# EAGLE design EnviroTron (EAGLE 8.5.0)
AUTHOR: w. boyett; CONTACT_ADDRESS: Licensed under CC-BY-SA; CONTACT_COMPANY: github.com/watsonboyett; CONTACT_PHONE: (Creative Commons, Attribution + Share Alike); REV: 1E
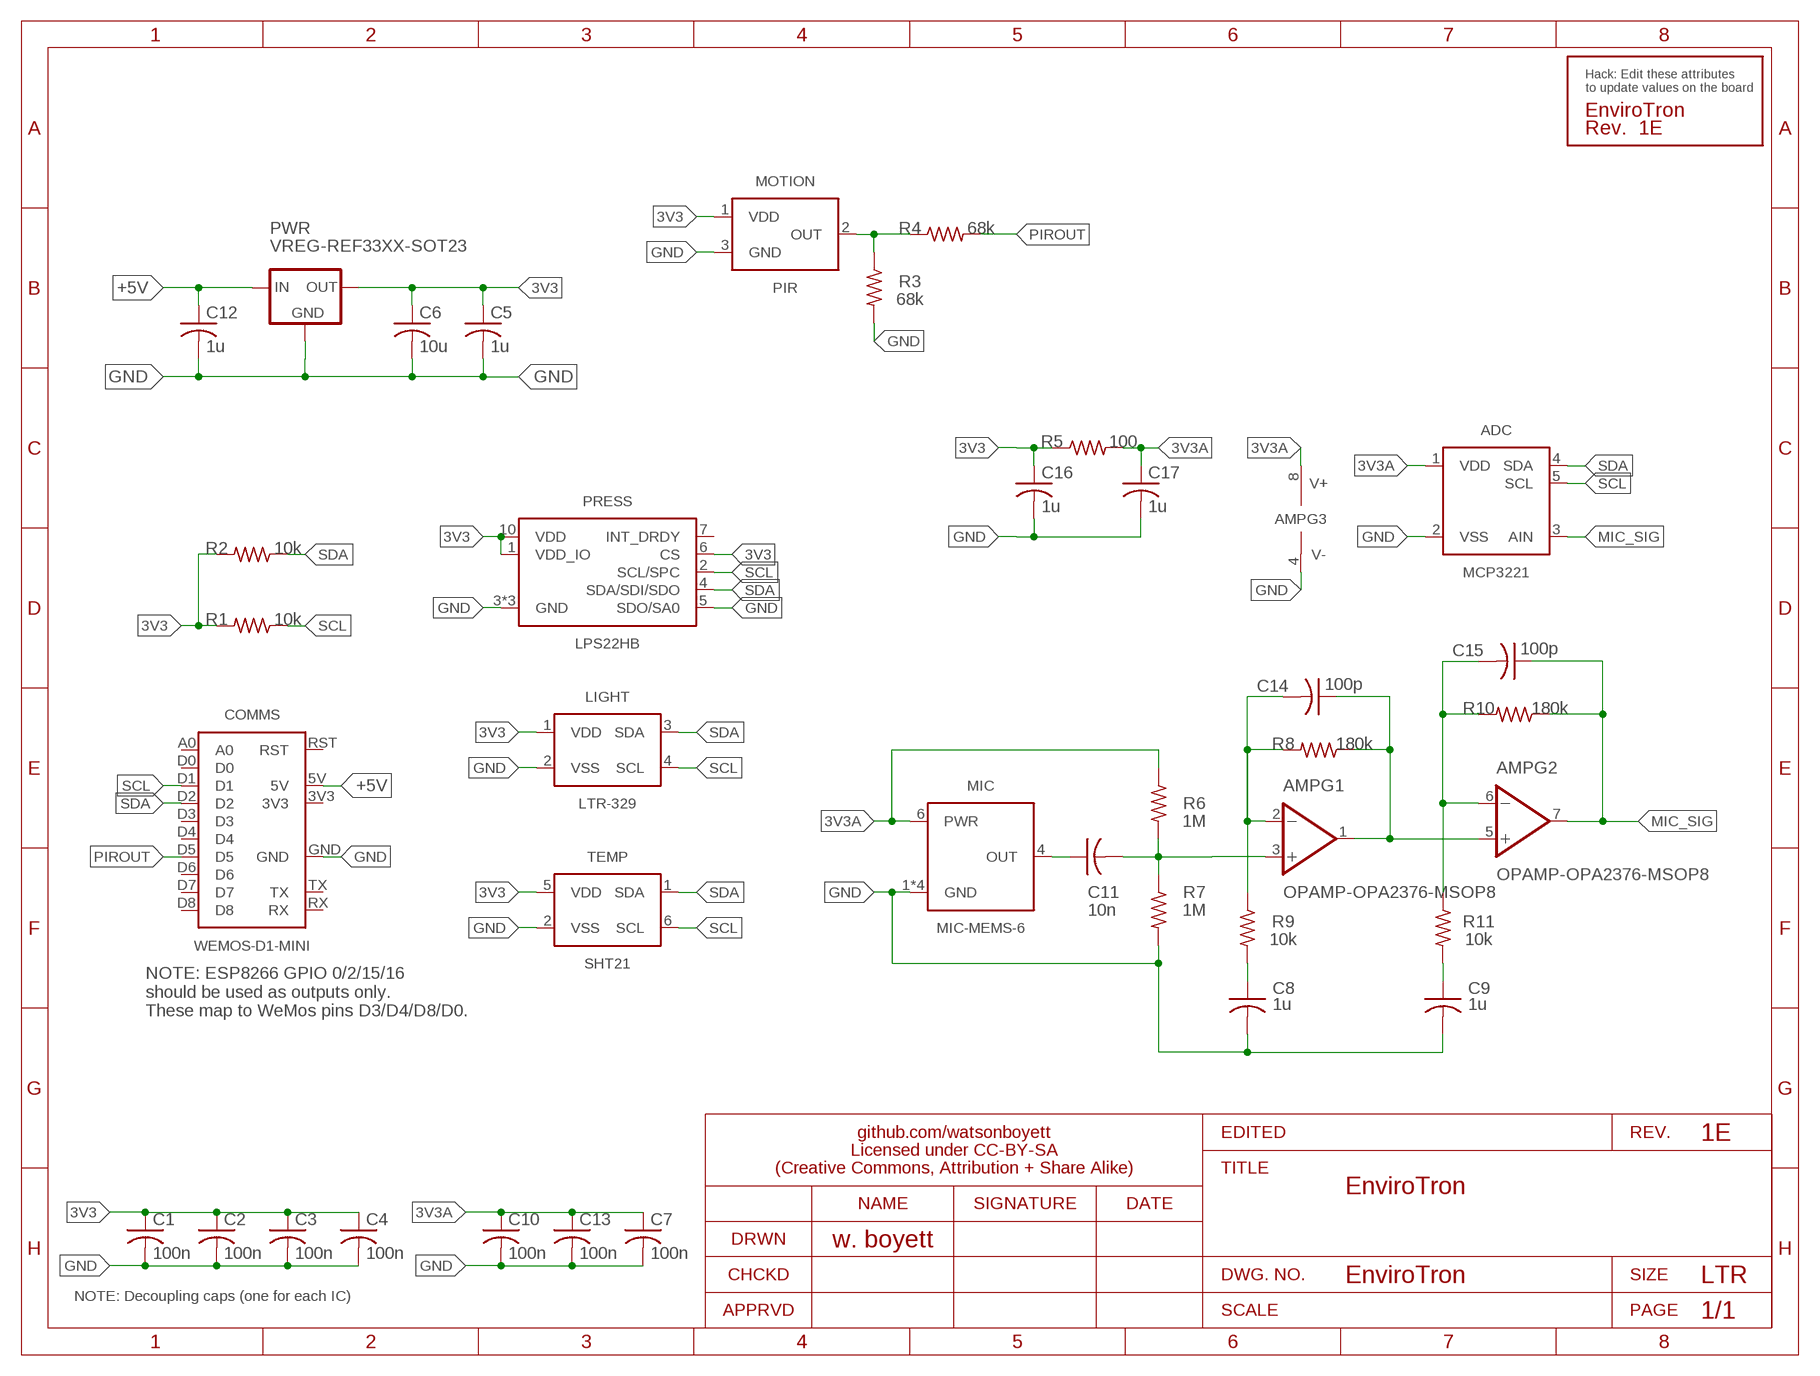
[diagram p0: schematic, sheet 1]
FRAME1 (LETTER_L): SECTION: Sensor Board

## Parts
ADC  MCP3221  [SOT23-5]
AMP  OPAMP-OPA2376-MSOP8  [MSOP-8]
C1  100n  C-USC0603  [C0603]
C2  100n  C-USC0603  [C0603]
C3  100n  C-USC0603  [C0603]
C4  100n  C-USC0603  [C0603]
C5  1u  C-USC0603  [C0603]
C6  10u  C-USC0805  [C0805]
C7  100n  C-USC0603  [C0603]
C8  1u  C-USC0603  [C0603]
C9  1u  C-USC0603  [C0603]
C10  100n  C-USC0603  [C0603]
C11  10n  C-USC0603  [C0603]
C12  1u  C-USC0603  [C0603]
C13  100n  C-USC0603  [C0603]
C14  100p  C-USC0603  [C0603]
C15  100p  C-USC0603  [C0603]
C16  1u  C-USC0603  [C0603]
C17  1u  C-USC0603  [C0603]
COMMS  WEMOS-D1-MINI  [WEMOS-D1-MINI]
LIGHT  LTR-329  [CHIPLED4]
MIC  MIC-MEMS-6  [DFN-6]
MOTION  PIR  [CAN3]
PRESS  LPS22HB  [HLGA-10L]
PWR  VREG-REF33XX-SOT23  [SOT23-3]
R1  10k  R-US_R0603  [R0603]
R2  10k  R-US_R0603  [R0603]
R3  68k  R-US_R0603  [R0603]
R4  68k  R-US_R0603  [R0603]
R5  100  R-US_R0603  [R0603]
R6  1M  R-US_R0603  [R0603]
R7  1M  R-US_R0603  [R0603]
R8  180k  R-US_R0603  [R0603]
R9  10k  R-US_R0603  [R0603]
R10  180k  R-US_R0603  [R0603]
R11  10k  R-US_R0603  [R0603]
TEMP  SHT21  [SHT2X-DFN6]
U$1  SILK_QC  [SILK_QC]

## Nets
3V3: C1.1 C2.1 C3.1 C4.1 C5.1 C6.1 C16.1 LIGHT.1(VDD) MOTION.1(VDD) PRESS.1(VDD_IO) PRESS.6(CS) PRESS.10(VDD) PWR.2(OUT) R1.2 R2.2 R5.1 TEMP.5(VDD)
3V3A: ADC.1(VDD) AMP.8(V+) C7.1 C10.1 C13.1 C17.1 MIC.6(PWR) R5.2 R6.1
+5V: C12.1 COMMS.5V PWR.1(IN)
GND: ADC.2(VSS) AMP.4(V-) C1.2 C2.2 C3.2 C4.2 C5.2 C6.2 C7.2 C8.2 C9.2 C10.2 C12.2 C13.2 C16.2 C17.2 COMMS.GND LIGHT.2(VSS) MIC.1(GND) MIC.2(GND) MIC.3(GND) MIC.5(GND) MOTION.3(GND) PRESS.3(GND) PRESS.5(SDO/SA0) PRESS.8(GND) PRESS.9(GND) PWR.3(GND) R3.2 R7.2 TEMP.2(VSS)
MIC_OUT: AMP.3(+IN) C11.2 R6.2 R7.1
MIC_SIG: ADC.3(AIN) AMP.7(OUT) C15.1 R10.1
N$2: AMP.1(OUT) AMP.5(+IN) C14.1 R8.1
N$3: MOTION.2(OUT) R3.1 R4.1
N$6: AMP.2(-IN) C14.2 R8.2 R9.1
N$7: C8.1 R9.2
N$8: C11.1 MIC.4(OUT)
N$9: AMP.6(-IN) C15.2 R10.2 R11.1
N$10: C9.1 R11.2
PIROUT: COMMS.D5 R4.2
SCL: ADC.5(SCL) COMMS.D1 LIGHT.4(SCL) PRESS.2(SCL/SPC) R1.1 TEMP.6(SCL)
SDA: ADC.4(SDA) COMMS.D2 LIGHT.3(SDA) PRESS.4(SDA/SDI/SDO) R2.1 TEMP.1(SDA)
Unconnected: COMMS.3V3 COMMS.A0 COMMS.D0 COMMS.D3 COMMS.D4 COMMS.D6 COMMS.D7 COMMS.D8 COMMS.RST COMMS.RX COMMS.TX PRESS.7(INT_DRDY)

## Notes on the sheet
- NOTE: ESP8266 GPIO 0/2/15/16 
  should be used as outputs only. 
  These map to WeMos pins D3/D4/D8/D0.
- NOTE: Decoupling caps (one for each IC)

## Library data of the parts
ADC = EnviroTron:MCP3221: IC ADC 12 Bit Analog to Digital Converter 1 Input 1 SAR SOT-23-5; MFG: Microchip Technology; MPN: MCP3221A5T-I/OT; PN-DK: MCP3221A5T-I/OTCT-ND
AMP = EnviroTron:OPAMP: IC OPAMP General Purpose Amplifier Circuit Rail-to-Rail; MFG: Texas Instruments; MPN: OPA2376AIDGKR; PN-DK: 296-22630-1-ND; SPICEPREFIX: J
C1-C17 = EnviroTron:C-US: CAPACITOR, American symbol
COMMS = EnviroTron:WEMOS-D1-MINI; SPICEPREFIX: X
LIGHT = EnviroTron:LTR-329: AMBIENT LIGHT PHOTO SENSOR Optical Sensor Ambient I²C; MFG: Lite-On Inc.; MPN: LTR-329ALS-01; PN-DK: 160-2160-1-ND
MIC = EnviroTron:MIC-MEMS: MEMS MIC Analog 100Hz ~ 10kHz (Silicon) 1.5 ~ 3.6V Omnidirectional (-42dB ±3dB @ 94dB SPL)
MOTION = EnviroTron:PIR: Sensor Motion, Pyroelectric, PIR (Passive Infrared) 197" (5m) 16.4' Polyethylene, Black Lens; MFG: Panasonic Electric Works; MPN: EKMC1601112; PN-DK: 255-3075-ND
PRESS = EnviroTron:LPS22HB: Pressure Sensor 3.77 PSI ~ 18.27 PSI (26 kPa ~ 126 kPa) Absolute 24 bit; MFG: STMicroelectronics; MPN: LPS22HBTR; PN-DK: 497-16265-1-ND
PWR = EnviroTron:VREG: IC Linear Voltage Regulator/Reference; MFG: Texas Instruments; MPN: REF3033AIDBZR; PN-DK: 296-26324-1-ND
R1-R11 = EnviroTron:R-US_: RESISTOR, American symbol
TEMP = EnviroTron:SHT21: SENSOR Humidity/Temperature 3V I2C 2%; MFG: Sensirion AG; MPN: SHT21; PN-DK: 1649-1005-1-ND
U$1 = EnviroTron:SILK_QC: Model/Version Tag Silkscreen; MPN: DNP; PRODUCT: EnviroTron; REV: 1E

## Board
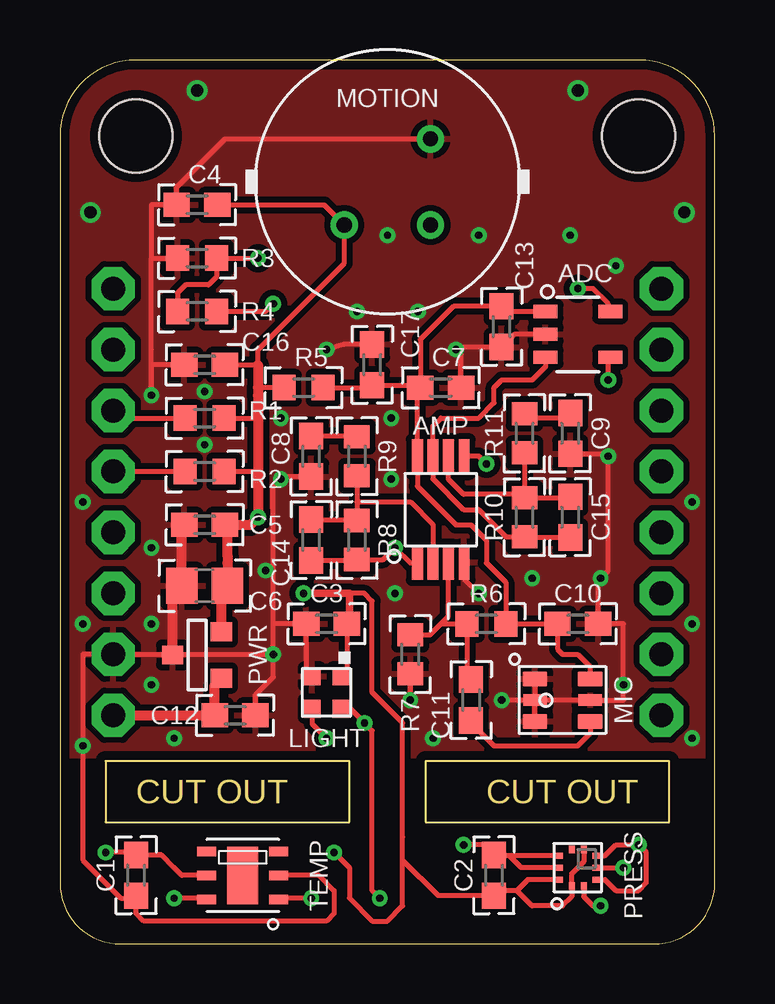
[diagram p1: board, top side]
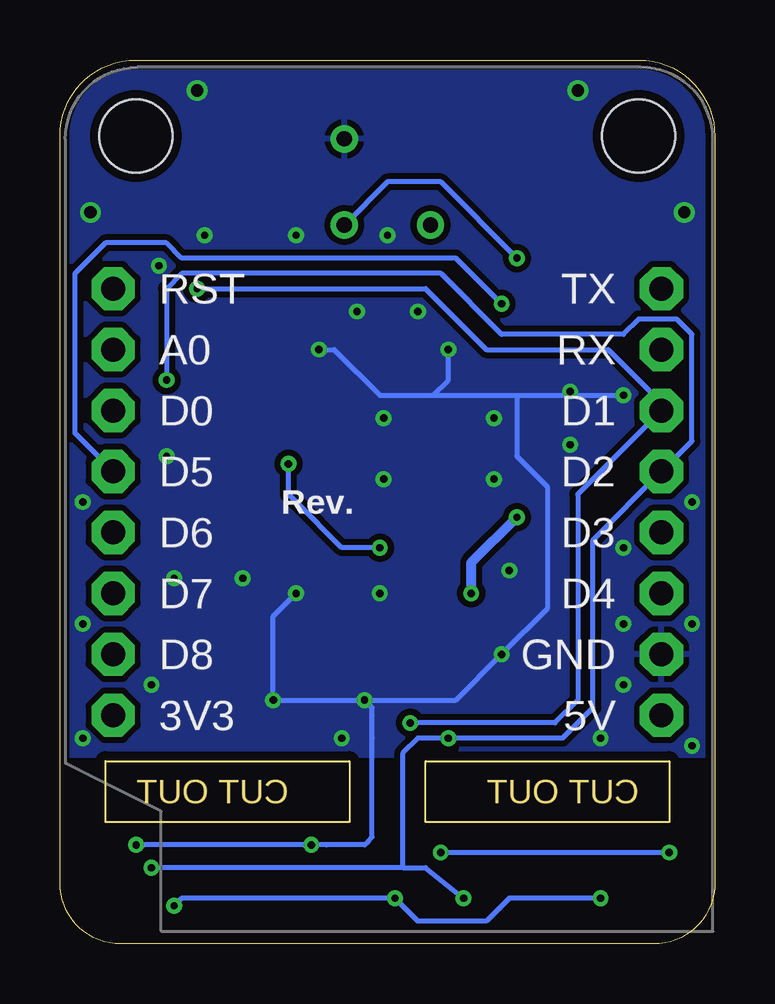
[diagram p2: board, bottom side, seen from below]

Size 27.3 x 36.83 mm. Coordinates in mm from the lower left corner, seen from the top.
Outline: 24.13,36.83 3.17,36.83 arc90 0,33.66 0,2.54 arc90 2.54,0 24.77,0 arc90 27.3,2.54 27.3,33.66 arc90 24.13,36.83
Outline: 1.91,7.62 1.91,5.08 12.06,5.08 12.06,7.62 1.91,7.62
Outline: 15.24,7.62 15.24,5.08 25.4,5.08 25.4,7.62 15.24,7.62
Copper layers (1*16): Top 0.0356mm / dielectric 1.5011mm / Bottom 0.0356mm
Design rules "OshPark-2layer-loosetol *": minimum track width 8mil, minimum drill 10mil, track to track 8mil, track to pad 8mil, pad to pad 7mil, via to via 8mil, smd to smd 7mil, copper to edge 15mil, drill to drill 6mil, minimum pad ring 10mil, minimum via ring 7mil, stop-mask expansion 2.5mil, vias tented up to drill 20mil, thermal gap 10mil
Holes 3.05 mm at 3.17,33.66 24.13,33.66

### Footprints (pad centres in the part's own frame; a part is rotated, then mirrored left to right if it is on the bottom)
SOT23-5 = smd 0.55 x 1: 1 -0.95,-1.35; 2 0,-1.35; 3 0.95,-1.35; 4 0.95,1.35; 5 -0.95,1.35
MSOP-8 = smd 0.45 x 1.45: 1 -0.975,-2.2; 2 -0.325,-2.2; 3 0.325,-2.2; 4 0.975,-2.2; 5 0.975,2.2; 6 0.325,2.2; 7 -0.325,2.2; 8 -0.975,2.2
C0603 = smd 1.1 x 1: 1 -0.85,0; 2 0.85,0
C0805 = smd 1.3 x 1.5: 1 -0.95,0; 2 0.95,0
WEMOS-D1-MINI = drill 1 octagon: 3V3 -11.43,-8.89; 5V 11.43,-8.89; A0 -11.43,6.35; D0 -11.43,3.81; D1 11.43,3.81; D2 11.43,1.27; D3 11.43,-1.27; D4 11.43,-3.81; D5 -11.43,1.27; D6 -11.43,-1.27; D7 -11.43,-3.81; D8 -11.43,-6.35; GND 11.43,-6.35; RST -11.43,8.89; RX 11.43,6.35; TX 11.43,8.89
CHIPLED4 = smd 0.7 x 0.75: 1 -0.6,-0.675; 2 0.6,-0.675; 3 0.6,0.675; 4 -0.6,0.675
DFN-6 = smd 1.032 x 0.622: 1 -1.15,0.884; 3 -1.15,-0.884; 4 1.15,-0.884; 6 1.15,0.884 | smd 1.032 x 0.5: 2 -1.15,0; 5 1.15,0
CAN3 = drill 0.635: 1 -1.796,-1.796; 2 1.796,-1.796; 3 1.796,1.796
HLGA-10L = smd 0.3 x 0.25: 1 -0.762,0.25; 2 -0.762,-0.25; 6 0.762,-0.25; 7 0.762,0.25 | smd 0.25 x 0.3: 3 -0.5,-0.762; 4 0,-0.762; 5 0.5,-0.762; 8 0.5,0.762; 9 0,0.762; 10 -0.5,0.762
SOT23-3 = smd 0.889 x 0.787: 1 1.016,-0.991; 2 1.016,0.94; 3 -1.016,-0.025
R0603 = smd 0.965 x 1.067: 1 -0.813,0; 2 0.813,0
SHT2X-DFN6 = smd 0.4 x 0.8: 1 -1,-1.5; 2 0,-1.5; 3 1,-1.5; 4 1,1.5; 5 0,1.5; 6 -1,1.5 | smd 2.4 x 1.3: 7 0,0

### Placement (x,y rotation side)
ADC  21.59,25.4 270 top
AMP  15.88,18.1 0 top
C1  3.17,2.86 270 top
C2  18.1,2.86 90 top
C3  11.11,13.34 180 top
C4  5.71,30.8 180 top
C5  6.03,17.46 180 top
C6  6.03,14.92 180 top
C7  15.88,23.18 0 top
C8  10.48,20.32 270 top
C9  21.27,21.27 270 top
C10  21.59,13.34 0 top
C11  17.14,10.16 90 top
C12  7.3,9.53 0 top
C13  18.41,25.72 270 top
C14  10.48,16.83 90 top
C15  21.27,17.78 90 top
C16  6.03,24.13 180 top
C17  13.02,24.13 90 top
COMMS  13.65,18.41 0 bottom
LIGHT  11.11,10.48 180 top
MIC  20.95,10.16 0 top
MOTION  13.65,31.75 0 top
PRESS  21.59,3.17 90 top
PWR  5.71,12.06 0 top
R1  6.03,21.91 0 top
R2  6.03,19.68 0 top
R3  5.71,28.57 180 top
R4  5.71,26.35 0 top
R5  10.16,23.18 0 top
R6  17.78,13.34 180 top
R7  14.61,12.06 270 top
R8  12.38,16.83 90 top
R9  12.38,20.32 90 top
R10  19.37,17.78 90 top
R11  19.37,21.27 90 top
TEMP  7.62,2.86 90 top
U$1  18.1,17.14 0 bottom

### Tracks (layer width: path | path; a pad name or v marks a point on that pad's centre or on a via)
3V3  (via drill 0.3)
  Top 0.203: PRESS.10 19.5,2.67 19.05,2.22 | 19.05,2.22 18.31,2.22 C2.1 15.77,2.01 14.29,3.49 | 19.05,2.22 19.68,1.59 20.95,1.59 21.34,1.97 PRESS.1 21.34,2.92 21.84,3.42 PRESS.6 | TEMP.5 5.08,2.86 4.76,3.17 4.23,3.71 | C1.1 4.23,3.71 | 6.99,19.68 R2.2 8.26,19.68 | 3.17,3.49 C1.1 | LIGHT.1 11.96,11.4 C3.1 12.06,13.34 | 4.23,3.71 4.03,3.71 | 6.99,15.88 6.99,16.19 | 12.06,14.61 12.7,14.61 13.02,14.29 13.02,10.48 14.29,9.21 14.29,4.45 14.29,3.49 | C1.1 3.07,3.81 v1.91,3.81 | C16.1 8.26,24.13 | R5.1 8.26,23.18 8.26,24.13 | C4.1 11.01,30.8 MOTION.1 11.86,28.37 8.26,24.77 8.26,24.13 | v11.43,3.81 12.06,3.17 12.06,1.91 13.02,0.95 13.65,0.95 14.29,1.59 14.29,3.49 | R1.2 8.26,21.91
  Top 0.305: v10.16,14.61 12.06,14.61 12.06,13.34
  Top 0.406: C5.1 6.99,17.36 6.99,16.19 6.99,15.88 C6.1 6.73,14.67 PWR.2 | 6.99,17.57 C5.1 | 8.26,24.13 8.26,23.18 8.26,22.86 8.26,21.91 8.26,19.68 v8.26,17.78 7.94,17.46 C5.1
  Bottom 0.203: v11.43,3.81 v1.91,3.81
  Bottom 0.406: v8.26,17.78 10.16,15.88 v10.16,14.61
3V3A
  Top 0.203: 14.9,23.05 AMP.8 14.9,19.07 16.51,17.46 17.14,17.46 17.78,16.83 17.78,15.88 18.59,15.06 R6.1 C10.1 20.74,12.28 20.95,12.06 21.59,12.06 22.11,11.55 MIC.6 | 14.9,23.05 C7.1 15.03,25.18 16.41,26.57 C13.1 18.63,26.35 ADC.1 | R5.2 12.91,23.18 C17.1 14.67,23.28 14.9,23.05
+5V
  Top 0.406: COMMS.5V C12.1 6.45,10.81 PWR.1
GND  (via drill 0.3, 0.51)
  Top 0.203: PRESS.8 18.73,3.67 | 18.73,3.67 18.1,3.67 C2.2 18.1,3.81 17.78,4.13 v16.83,4.13 | PRESS.9 19.23,3.17 18.73,3.67 | PRESS.5 22.73,3.67 23.18,4.13 v24.13,4.13 24.45,3.81 24.45,2.54 24.13,2.22 23.18,2.22 22.73,2.67 PRESS.3 | TEMP.2 10.79,2.86 11.43,2.22 11.43,1.27 11.11,0.95 3.49,0.95 3.17,1.27 3.17,1.91 | 3.17,1.91 2.54,1.91 0.95,3.49 0.95,4.45 0.95,5.08 0.95,12.06 COMMS.GND 4.67,12.06 PWR.3 5.05,12.04 5.08,12.06 v8.89,12.06 | LIGHT.2 10.26,11.4 C3.2 8.89,13.34 | 3.17,1.91 C1.2 | v8.89,12.06 8.89,13.34 | 8.89,13.34 8.89,19.05 9.11,19.47 C8.2 | v8.89,12.06 8.89,11.11 8.15,10.38 C12.2 | AMP.4 16.85,15.22 v17.46,14.61 | v14.61,10.16 R7.2 | MIC.1 MIC.2 | MIC.3 MIC.2 | MIC.2 MIC.5 23.5,10.16 23.5,13.34 C10.2 22.44,15.14 v22.54,15.24 22.86,15.56 v22.86,20.32 22.76,20.42 C9.2 | MIC.2 v18.41,10.16 | ADC.2 18.95,25.4 C13.2 16.61,24.87 v16.51,24.77 16.73,24.55 C7.2 | C16.2 3.81,24.13 | 3.81,24.13 v3.81,22.86 3.81,24.13 | C17.2 11.85,24.98 v11.11,24.77 | 3.81,24.13 3.81,24.77 3.81,28.57 | 3.81,28.57 R3.2 | 3.81,28.57 3.81,29.21 3.81,30.8 C4.2 4.87,31.54 6.88,33.55 MOTION.3
  Top 0.406: C5.2 5.08,17.36 C6.2 4.7,14.54 PWR.3 4.67,12.06
  Bottom 0.203: v24.13,4.13 23.81,4.13 17.14,4.13 v16.83,4.13 16.19,4.13 14.61,4.13 14.45,4.29 14.29,4.45 14.29,8.57 14.29,9.53 14.29,9.84 v14.61,10.16 | v14.61,10.16 10.79,10.16 v8.89,12.06 6.99,13.97 6.99,19.05 8.26,20.32 8.26,22.86 | v17.46,14.61 18.41,13.65 v18.41,10.16 v14.61,10.16 | v16.51,24.77 15.88,24.77 13.97,22.86 11.75,22.86 | 11.75,22.86 8.26,22.86 | 8.26,22.86 v3.81,22.86 | 11.75,22.86 11.11,23.5 v11.11,24.77
  other vias: 13.97,14.61 5.71,35.56 21.59,35.56 1.27,30.48 26.04,30.48 13.81,19.37 9.21,19.37 8.57,15.56 0.95,18.41 0.95,8.26 3.81,10.79 3.81,13.34 3.81,16.51 4.76,8.57 15.56,8.57 26.35,8.57 26.35,18.41 0.95,13.34 26.35,13.34 23.18,28.26 6.03,20.8 6.03,23.02 13.81,21.91 9.21,21.91 19.68,15.24 23.5,10.79 12.38,26.35 14.92,26.35 13.65,29.53 17.46,29.53 21.27,29.53
  pour Top (isolate 0.254, rank 2): 0.32,0.32 0.32,36.83 26.99,36.83 26.99,0.32
  pour Bottom (isolate 0.254, rank 2): 0.32,0.32 0.32,36.83 26.99,36.83 26.99,0.32
MIC_OUT
  Top 0.203: 15.88,13.34 16.19,13.65 16.19,16.19 16.2,16.2 AMP.3 | C11.2 17.14,11.11 16.97,11.29 R6.2 15.88,13.34 | R7.1 15.42,12.88 15.88,13.34
MIC_SIG
  Top 0.203: C15.1 19.37,16.93 R10.1 18.59,16.97 17.46,18.1 16.83,18.1 15.55,19.38 AMP.7 15.55,21.58 15.88,21.91 17.46,21.91 18.1,22.54 18.1,23.18 18.41,23.5 19.68,23.5 20.24,24.05 ADC.3
N$1
  cutout Bottom (isolate 1.27): 0.32,7.62 26.99,7.62 26.99,0.32 0.32,0.32
  cutout Top (isolate 1.27): 0.32,7.62 26.99,7.62 26.99,0.32 0.32,0.32
N$2  (via drill 0.3)
  Top 0.203: v17.78,20 17.46,20.32 16.83,20.32 16.83,20.27 AMP.5 | C14.1 12.38,15.98 R8.1 13.47,16.02 v13.97,16.51 14.61,15.88 14.88,15.88 AMP.1 14.92,15.92
  Bottom 0.203: v13.97,16.51 15.56,16.51 17.46,18.41 17.78,18.73 v17.78,20
N$3  (via drill 0.3)
  Top 0.203: R4.1 4.9,27.13 5.24,27.46 6.19,27.46 6.53,27.8 R3.1 v8.26,28.57
  Bottom 0.203: v8.26,28.57 11.43,31.75 13.65,31.75 MOTION.2
N$6
  Top 0.203: R9.1 12.38,18.41 | 12.38,18.41 14.61,18.41 15.56,17.46 15.56,16.51 15.56,16.22 AMP.2 | 12.38,18.41 R8.2 12.38,17.68 C14.2
N$7
  Top 0.203: C8.1 12.03,21.17 R9.2
N$8
  Top 0.203: 17.14,9.21 C11.1 17.14,9.21 | MIC.4 22.11,8.77 21.59,8.26 18.1,8.26 17.14,9.21
N$9
  Top 0.203: R11.1 19.37,18.73 | AMP.6 16.19,19.37 16.83,18.73 19.37,18.73 | AMP.6 16.19,20.32 AMP.6 | 19.37,18.73 R10.2 21.59,18.59 C15.2 | AMP.6
N$10
  Top 0.203: R11.2 19.68,21.91 20.64,21.91 21.59,21.91 C9.1
PIROUT  (via drill 0.3)
  Top 0.203: R4.2 8.57,26.35 v8.89,26.67
  Bottom 0.203: v8.89,26.67 10.79,28.57 22.23,28.57 22.86,29.21 25.4,29.21 26.67,27.94 26.67,21.27 COMMS.D5
SCL  (via drill 0.3)
  Top 0.203: PRESS.2 21.84,1.97 22.23,1.59 v22.54,1.59 | COMMS.D1 2.54,21.91 R1.1 | v13.34,1.91 13.02,2.22 13.02,8.89 v12.7,9.21 12.11,9.8 LIGHT.4 | TEMP.6 5.99,1.86 5.71,1.91 v4.76,1.91 | ADC.5 22.86,26.43 22.86,26.67 22.23,27.3 v21.59,27.3
  Bottom 0.203: v22.54,1.59 22.23,1.91 v13.34,1.91 12.38,0.95 9.53,0.95 8.57,1.91 v4.76,1.91 | v12.7,9.21 12.38,9.21 6.67,9.21 5.71,10.16 5.71,18.73 COMMS.D1 2.22,22.54 3.17,23.5 4.45,24.77 9.53,24.77 12.06,27.3 v21.59,27.3
SDA  (via drill 0.3)
  Top 0.203: PRESS.4 v23.5,3.17 | COMMS.D2 R2.1 | v10.48,1.91 9.21,1.91 TEMP.1 | LIGHT.3 10.51,9.17 v11.11,8.57 | v22.86,23.5 22.86,24.37 ADC.4
  Bottom 0.203: 13.02,3.17 v23.5,3.17 | 13.02,3.17 13.02,7.94 12.38,8.57 v11.11,8.57 6.35,8.57 5.08,9.84 5.08,16.83 COMMS.D2 0.95,20.95 0.95,25.4 1.59,26.04 3.17,26.04 3.81,25.4 8.89,25.4 11.43,27.94 22.23,27.94 22.86,27.3 v22.86,23.5 | 13.02,3.17 12.06,3.17 v10.48,1.91

### Text on the board
Dimension: CUT OUT | CUT OUT